# Altium schematic sheet MCU.SchDoc
size A; SheetNumber: 6; SheetTotal: 6
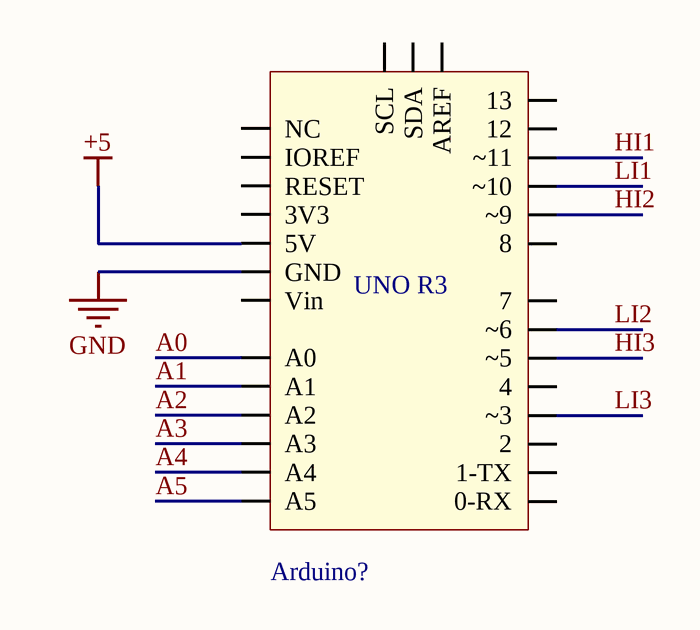
[diagram p0: MCU.SchDoc]

## Parts
Arduino?  Arduino Uno R3  [ARDUINO_A000066]  (value not drawn)

## Nets
+5: Arduino?.5V
GND: Arduino?.GND
A0: Arduino?.A0
A1: Arduino?.A1
A2: Arduino?.A2
A3: Arduino?.A3
A4: Arduino?.A4
A5: Arduino?.A5
HI1: Arduino?.~11
HI2: Arduino?.~9
HI3: Arduino?.~5
LI1: Arduino?.~10
LI2: Arduino?.~6
LI3: Arduino?.~3

Not connected (* = marked no-connect by the designer): Arduino? 0-RX 1-TX 2 3V3 4 7 8 12 13 AREF IOREF NC RESET SCL SDA Vin

## Notes on the sheet
- (in symbol Arduino Uno R3) UNO R3

## Library data of the parts
Arduino? = Arduino Uno R3: Value: Cau 1A